# Altium schematic sheet 0_iip_closure.SchDoc: IIP Hardware Architecture (special schematic for IIP Nº4 Board)
size A4; DocumentNumber: 1; Revision: v2.0; SheetNumber: 1; SheetTotal: 1
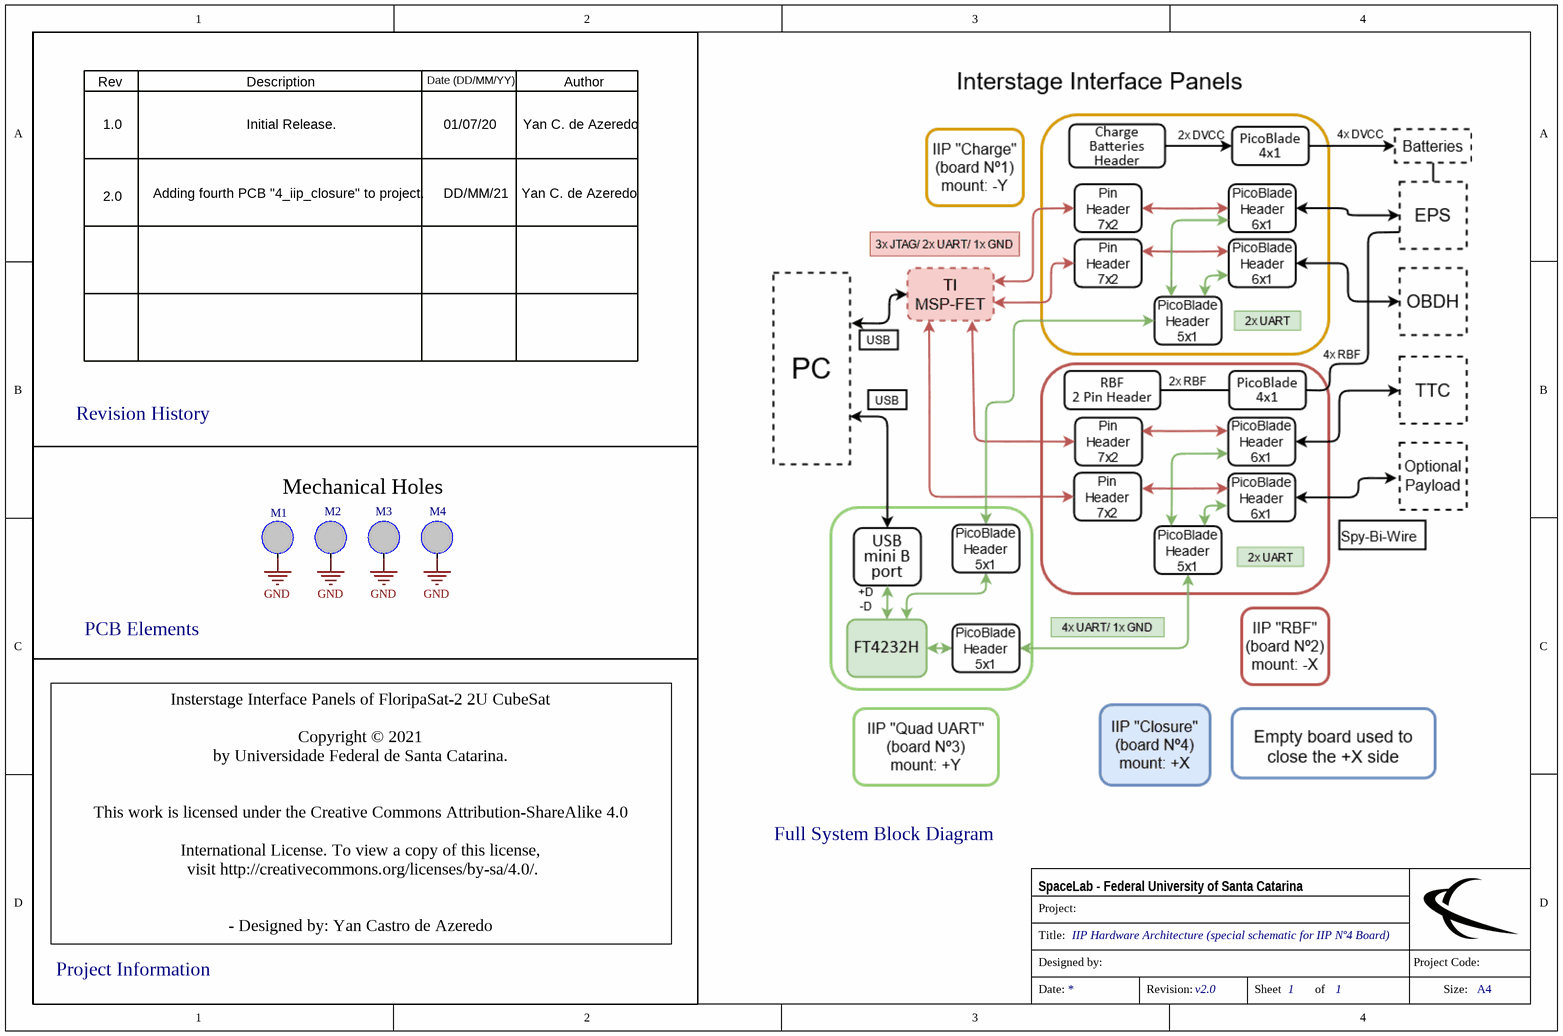
[diagram p0: 0_iip_closure.SchDoc]

## Parts
M1  IB Mechanical Hole  [M3 hole (5.5mm pad)]  (value not drawn)  (no BOM)
M2  IB Mechanical Hole  [M3 hole (5.5mm pad)]  (value not drawn)  (no BOM)
M3  IB Mechanical Hole  [M3 hole (5.5mm pad)]  (value not drawn)  (no BOM)
M4  IB Mechanical Hole  [M3 hole (5.5mm pad)]  (value not drawn)  (no BOM)

## Nets
GND: M1.0 M2.0 M3.0 M4.0

## Notes on the sheet
- Rev
- Description
- Date (DD/MM/YY)
- Author
- 1.0
- Initial Release.
- 01/07/20
- Yan C. de Azeredo
- 2.0
- Adding fourth PCB "4_iip_closure" to project.
- DD/MM/21
- Revision History
- Mechanical Holes
- PCB Elements
- Full System Block Diagram
- Insterstage Interface Panels of FloripaSat-2 2U CubeSat
  Copyright © 2021
  by Universidade Federal de Santa Catarina.
  This work is licensed under the Creative Commons Attribution-ShareAlike 4.0
  International License. To view a copy of this license,
  visit http://creativecommons.org/licenses/by-sa/4.0/.
  - Designed by: Yan Castro de Azeredo
  - Reviewers: Gabriel M. Marcelino and André M. P. Mattos
  - Support: Gabriel M. Marcelino, André M. P. Mattos and Kleber Gouveia
  - Mechanical validation: Edemar Morsch Filho
- Project Information
- Project:
- SpaceLab - Federal University of Santa Catarina
- Title:
- Designed by:
- Project Code:
- Date:
- Revision:
- Sheet
- of
- Size:
- A4

## Library data of the parts
M1-M4 = IB Mechanical Hole: Mechanical Hole for FloripaSat-2 interface boards